# Altium schematic sheet REGULADORES.SchDoc
size A3; SheetNumber: 4; SheetTotal: 7
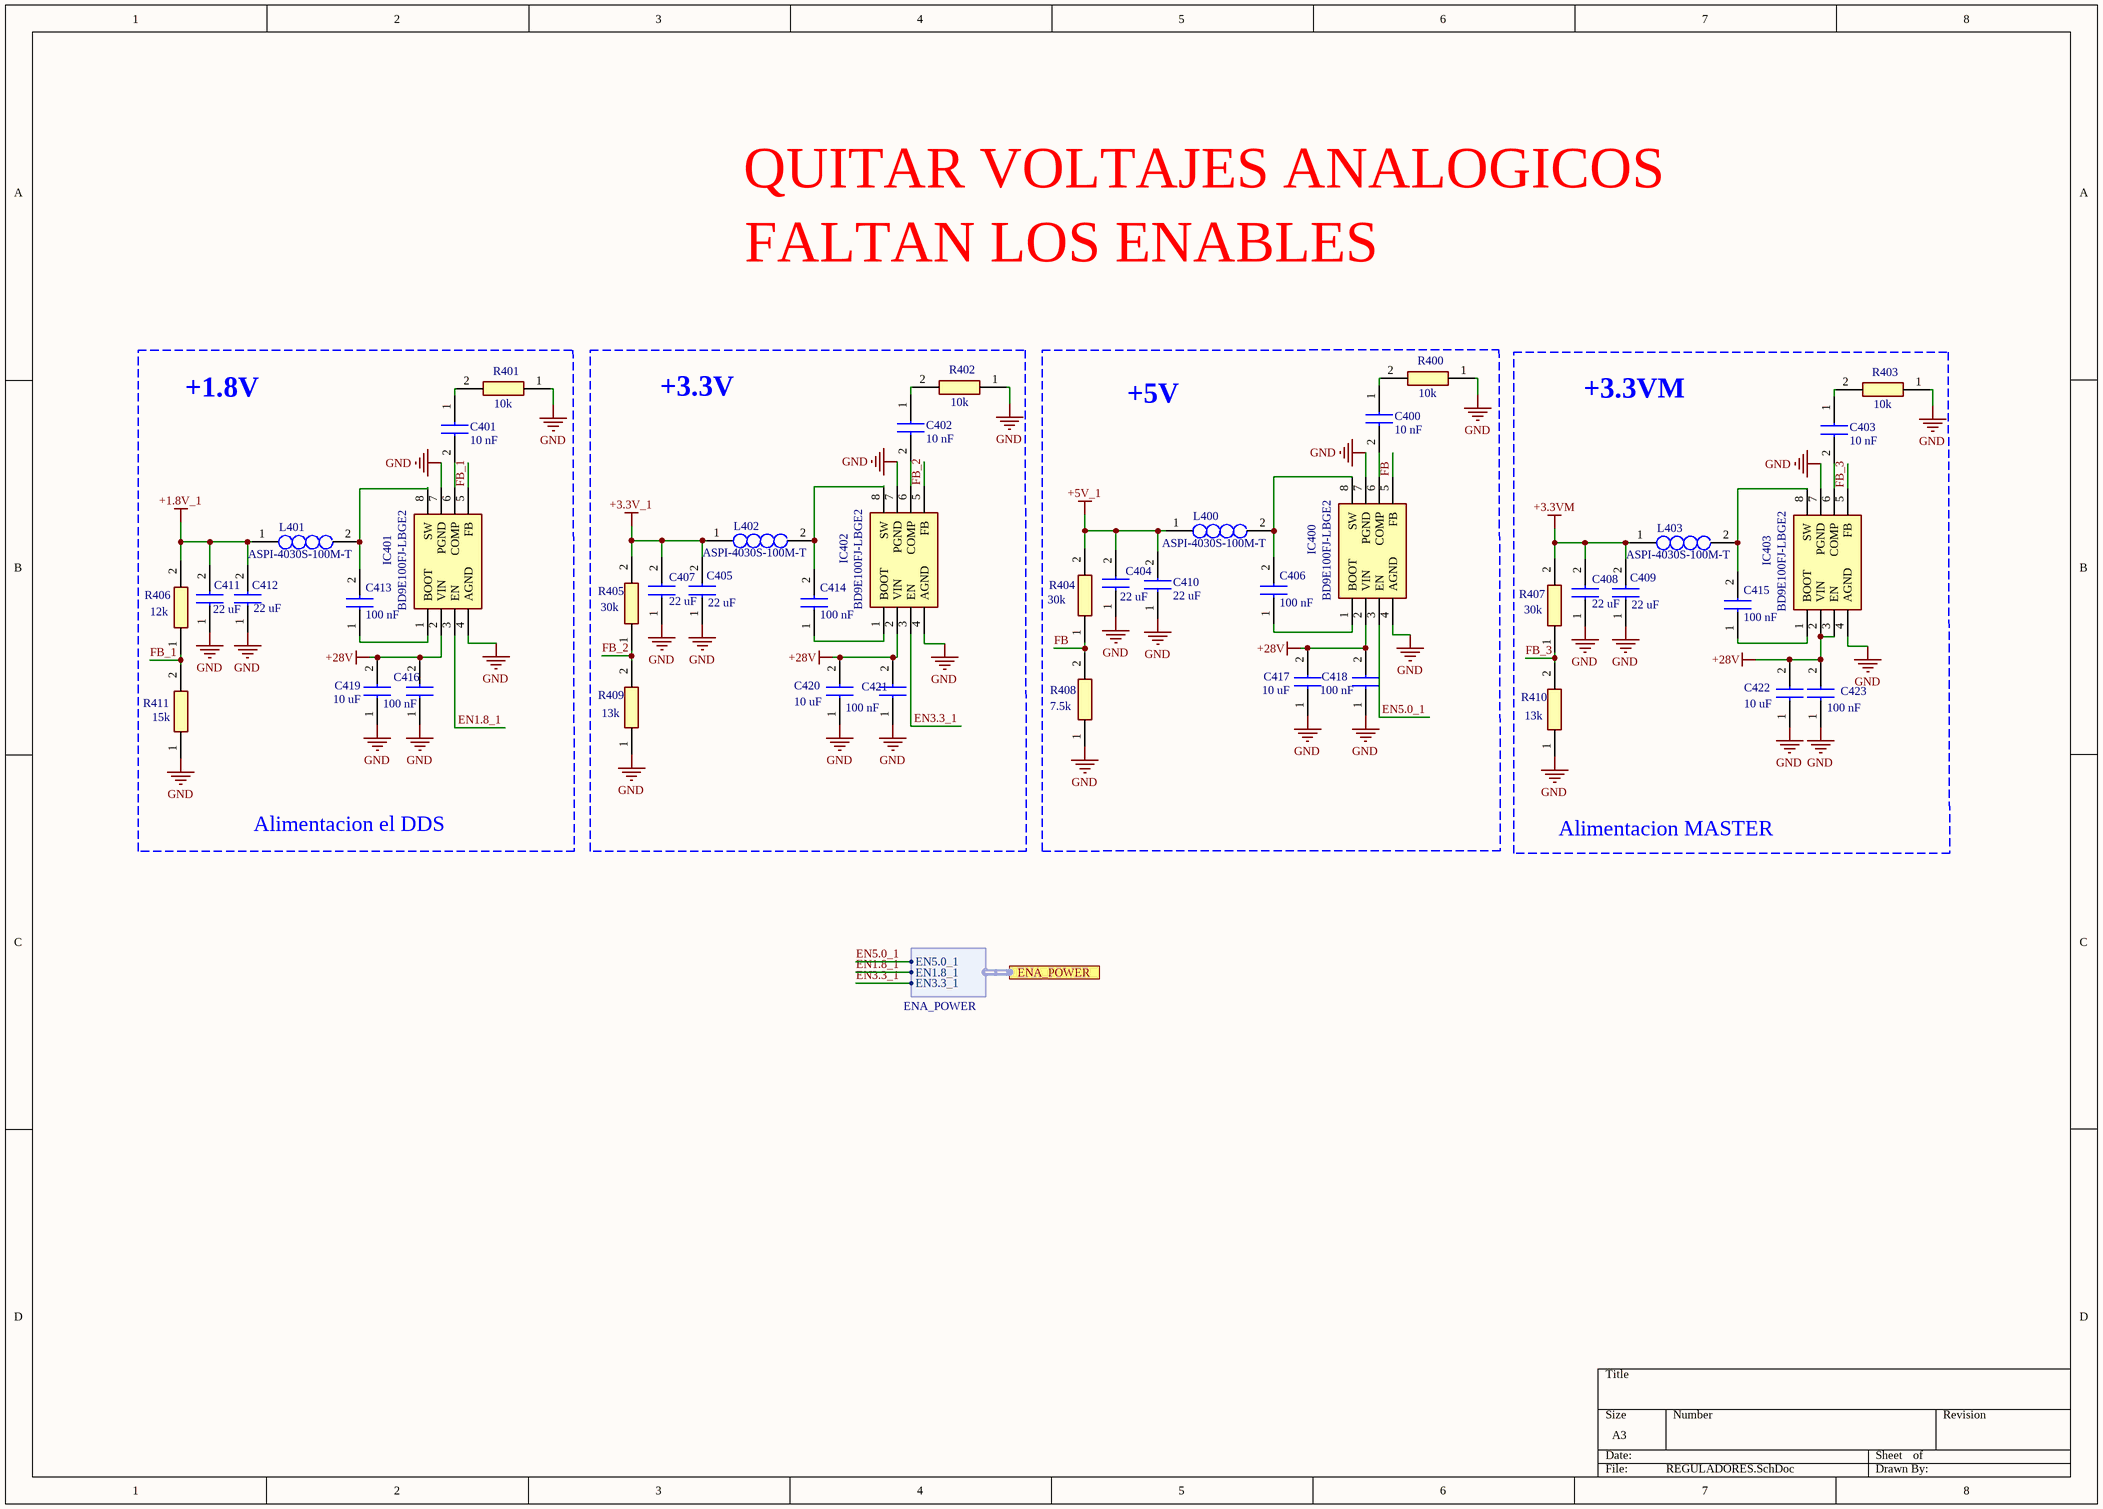
[diagram p0: REGULADORES.SchDoc]

## Parts
C400  10 nF  [C0603]
C401  10 nF  [C0603]
C402  10 nF  [C0603]
C403  10 nF  [C0603]
C404  22 uF  [CAPC3216X94N]
C405  22 uF  [CAPC3216X94N]
C406  100 nF  [C0603]
C407  22 uF  [CAPC3216X94N]
C408  22 uF  [CAPC3216X94N]
C409  22 uF  [CAPC3216X94N]
C410  22 uF  [CAPC3216X94N]
C411  22 uF  [CAPC3216X94N]
C412  22 uF  [CAPC3216X94N]
C413  100 nF  [C0603]
C414  100 nF  [C0603]
C415  100 nF  [C0603]
C416  100 nF  [CAPC3216X94N]
C417  10 uF  [CAPC3216X94N]
C418  100 nF  [CAPC3216X94N]
C419  10 uF  [CAPC3216X94N]
C420  10 uF  [CAPC3216X94N]
C421  100 nF  [CAPC3216X94N]
C422  10 uF  [CAPC3216X94N]
C423  100 nF  [CAPC3216X94N]
IC400  BD9E100FJ-LBGE2  [SOIC127P600X165-8N]
IC401  BD9E100FJ-LBGE2  [SOIC127P600X165-8N]
IC402  BD9E100FJ-LBGE2  [SOIC127P600X165-8N]
IC403  BD9E100FJ-LBGE2  [SOIC127P600X165-8N]
L400  ASPI-4030S-100M-T  [ASPI-4030S]
L401  ASPI-4030S-100M-T  [ASPI-4030S]
L402  ASPI-4030S-100M-T  [ASPI-4030S]
L403  ASPI-4030S-100M-T  [ASPI-4030S]
R400  10k  [RESC1608X55N]
R401  10k  [RESC1608X55N]
R402  10k  [RESC1608X55N]
R403  10k  [RESC1608X55N]
R404  30k  [RESC1608X55N]
R405  30k  [RESC1608X55N]
R406  12k  [RESC1608X55N]
R407  30k  [RESC1608X55N]
R408  7.5k  [RESC1608X55N]
R409  13k  [RESC1608X55N]
R410  13k  [RESC1608X55N]
R411  15k  [RESC1608X55N]

## Blocks framed on the sheet
+1.8V: C401 C411-C413 C416 C419 IC401 L401 R401 R406 R411
+3.3V: C402 C405 C407 C414 C420 C421 IC402 L402 R402 R405 R409
+5V: C400 C404 C406 C410 C417 C418 IC400 L400 R400 R404 R408
+3.3VM: C403 C408 C409 C415 C422 C423 IC403 L403 R403 R407 R410

## Ports
ENA_POWER (harness ENA_POWER)

## Harnesses
ENA_POWER: EN5.0_1, EN1.8_1, EN3.3_1

## Nets
+1.8V_1: C411.2 C412.2 L401.1 R406.2
+3.3V_1: C405.2 C407.2 L402.1 R405.2
+3.3VM: C408.2 C409.2 L403.1 R407.2
+5V_1: C404.2 C410.2 L400.1 R404.2
+28V: C416.2 C417.2 C418.2 C419.2 C420.2 C421.2 C422.2 C423.2 IC400.2(VIN) IC401.2(VIN) IC402.2(VIN) IC403.2(VIN) IC403.3(EN)
GND: C404.1 C405.1 C407.1 C408.1 C409.1 C410.1 C411.1 C412.1 C416.1 C417.1 C418.1 C419.1 C420.1 C421.1 C422.1 C423.1 IC400.4(AGND) IC400.7(PGND) IC401.4(AGND) IC401.7(PGND) IC402.4(AGND) IC402.7(PGND) IC403.4(AGND) IC403.7(PGND) R400.1 R401.1 R402.1 R403.1 R408.1 R409.1 R410.1 R411.1
EN1.8_1: IC401.3(EN) ; port ENA_POWER.EN1.8_1
EN3.3_1: IC402.3(EN) ; port ENA_POWER.EN3.3_1
EN5.0_1: IC400.3(EN) ; port ENA_POWER.EN5.0_1
FB: IC400.5(FB) R404.1 R408.2
FB_1: IC401.5(FB) R406.1 R411.2
FB_2: IC402.5(FB) R405.1 R409.2
FB_3: IC403.5(FB) R407.1 R410.2
NetC400_1: C400.1 R400.2
NetC400_2: C400.2 IC400.6(COMP)
NetC401_1: C401.1 R401.2
NetC401_2: C401.2 IC401.6(COMP)
NetC402_1: C402.1 R402.2
NetC402_2: C402.2 IC402.6(COMP)
NetC403_1: C403.1 R403.2
NetC403_2: C403.2 IC403.6(COMP)
NetC406_1: C406.1 IC400.1(BOOT)
NetC406_2: C406.2 IC400.8(SW) L400.2
NetC413_1: C413.1 IC401.1(BOOT)
NetC413_2: C413.2 IC401.8(SW) L401.2
NetC414_1: C414.1 IC402.1(BOOT)
NetC414_2: C414.2 IC402.8(SW) L402.2
NetC415_1: C415.1 IC403.1(BOOT)
NetC415_2: C415.2 IC403.8(SW) L403.2

## Notes on the sheet
- QUITAR VOLTAJES ANALOGICOS
- FALTAN LOS ENABLES
- Alimentacion el DDS
- Alimentacion MASTER

## Library data of the parts
C400-C403 C406 C413-C415 = C0603H470J5GACTU: Capacitor; Manufacturer_Name: KEMET; Datasheet Link: https://content.kemet.com/datasheets/KEM_C1001_C0G_200C_SMD.pdf; Height: 0.87mm; Manufacturer_Part_Number: C0603H470J5GACTU
C404 C405 C407-C412 C416-C423 = KAM31BR81H103KT: Capacitor; Manufacturer_Name: KYOCERA; Datasheet Link: https://datasheets.kyocera-avx.com/AutoMLCCKAM.pdf; Height: 0.94mm; Manufacturer_Part_Number: KAM31BR81H103KT; Mouser Part Number: 581-KAM31BR81H103KT; Mouser Price/Stock: https://www.mouser.co.uk/ProductDetail/KYOCERA-AVX/KAM31BR81H103KT?qs=Jm2GQyTW%2FbjzijSUJGW%2FJA%3D%3D
IC400-IC403 = BD9E100FJ-LBGE2: Integrated Circuit; Manufacturer_Name: ROHM Semiconductor; Datasheet Link: https://datasheet.datasheetarchive.com/originals/distributors/Datasheets_SAMA/31552bfffa195156420cd125ef757f50.pdf; Height: 1.65mm; Manufacturer_Part_Number: BD9E100FJ-LBGE2; Mouser Part Number: 755-BD9E100FJ-LBGE2; Mouser Price/Stock: https://www.mouser.co.uk/ProductDetail/ROHM-Semiconductor/BD9E100FJ-LBGE2?qs=ld%2F9eczBH1Djem76D2cPIg%3D%3D; Arrow Part Number: BD9E100FJ-LBGE2; Arrow Price/Stock: https://www.arrow.com/en/products/bd9e100fj-lbge2/rohm-semiconductor?region=nac
L400-L403 = ASPI-4030S-100M-T: Inductor; Manufacturer_Name: ABRACON; Datasheet Link: https://abracon.com/Magnetics/power/ASPI-4030S.pdf; Height: 3mm; Manufacturer_Part_Number: ASPI-4030S-100M-T; Mouser Part Number: 815-ASPI-4030S-100MT; Mouser Price/Stock: https://www.mouser.co.uk/ProductDetail/ABRACON/ASPI-4030S-100M-T?qs=BLmuIjeT3qH3cD5M%252B06ufg%3D%3D; Arrow Part Number: ASPI-4030S-100M-T; Arrow Price/Stock: https://www.arrow.com/en/products/aspi-4030s-100m-t/abracon?region=nac
R400-R411 = CR0603-FX-1431ELF: Resistor; Manufacturer_Name: Bourns; Datasheet Link: https://www.bourns.com/pdfs/chpreztr.pdf; Height: 0.55mm; Manufacturer_Part_Number: CR0603-FX-1431ELF; Mouser Part Number: 652-CR0603FX-1431ELF; Mouser Price/Stock: https://www.mouser.co.uk/ProductDetail/Bourns/CR0603-FX-1431ELF?qs=e7cxVwPieurCzASkAzK2%252Bg%3D%3D